# EAGLE design multi-pcb-other (EAGLE 9.6.2)
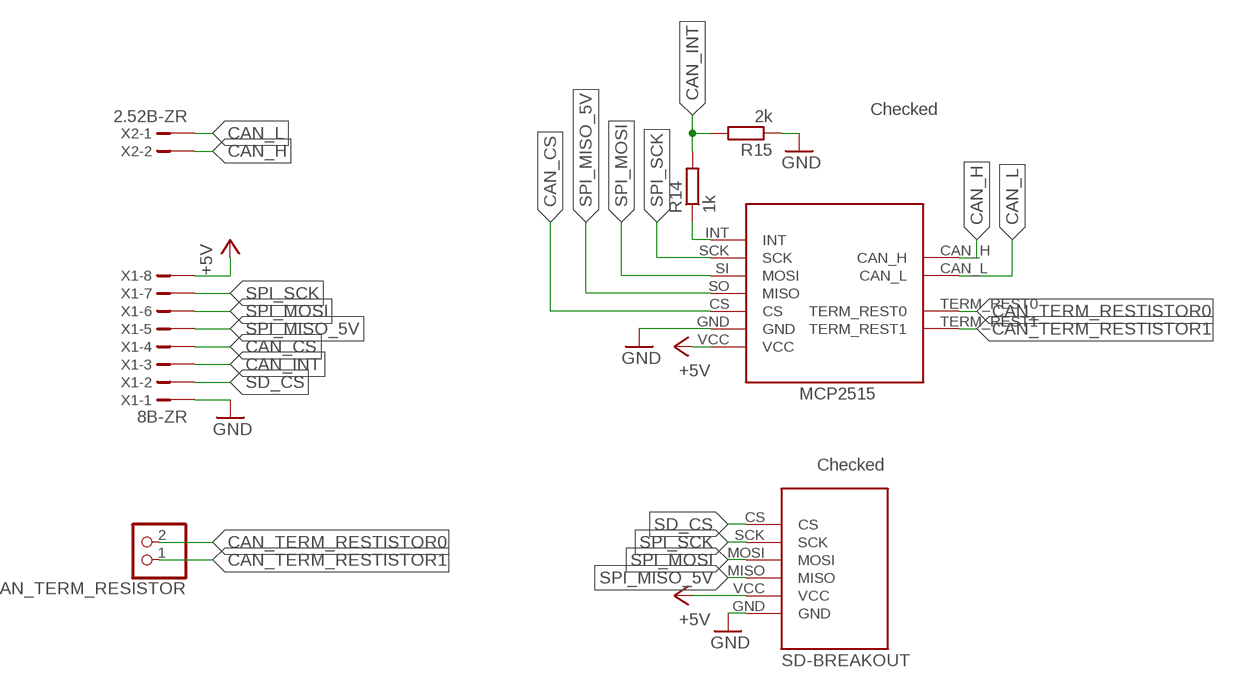
[diagram p0: schematic, sheet 1]

## Parts
CAN_TERM_RESISTOR  PINHD-1X2  [1X02]
R14  1k  R-EU_0207/10  [0207/10]
R15  2k  R-EU_0207/10  [0207/10]
U$2  MCP2515_DEVBOARDMCP2515_DEVBOARD_INVERTED_NODRILL  [MCP2515_DEVBOARD_INVERTED_NODRILL]
U$5  HKD-MICRO-SD-BREAKOUT  [HKD-MICRO-SD-BREAKOUT_NODRILL]
X1  8B-ZR  [B8B-ZR2.5]
X2  2.52B-ZR  [B2B-ZR2.5]

## Nets
+5V: U$2.VCC U$5.VCC X1.8
CAN_CS: U$2.CS X1.4
CAN_H: U$2.CAN_H X2.2
CAN_INT: R14.2 R15.2 X1.3
CAN_L: U$2.CAN_L X2.1
CAN_TERM_RESTISTOR0: CAN_TERM_RESISTOR.2 U$2.TERM_REST0
CAN_TERM_RESTISTOR1: CAN_TERM_RESISTOR.1 U$2.TERM_REST1
GND: R15.1 U$2.GND U$5.GND X1.1
N$10: R14.1 U$2.INT
SD_CS: U$5.CS X1.2
SPI_MISO_5V: U$2.SO(MISO) U$5.MISO X1.5
SPI_MOSI: U$2.SI(MOSI) U$5.MOSI X1.6
SPI_SCK: U$2.SCK U$5.SCK X1.7

## Notes on the sheet
- Checked
- Checked

## Library data of the parts
CAN_TERM_RESISTOR = pinhead:PINHD-1X2: PIN HEADER
R14 R15 = rcl:R-EU_: RESISTOR, European symbol; SPICEPREFIX: R
U$2 = MCP2515:MCP2515_DEVBOARD
U$5 = samuel:HKD-MICRO-SD-BREAKOUT
X1 = con-jst-custom:?8B-ZR: ZH CONNECTOR 1.5 mm, 4 pin 1 row Source: http://www.jst.com .. eZH.pdf
X2 = con-jst-custom:?2B-ZR: ZH CONNECTOR 1.5 mm, 4 pin 1 row Source: http://www.jst.com .. eZH.pdf

## Board
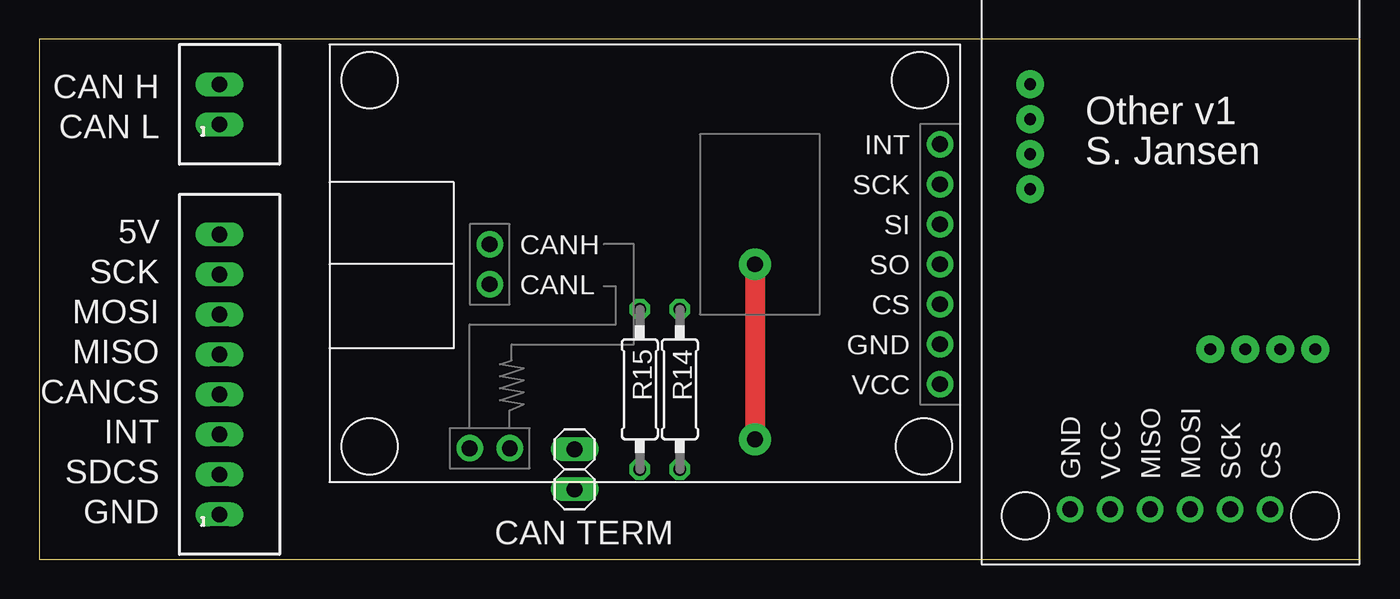
[diagram p1: board, top side]
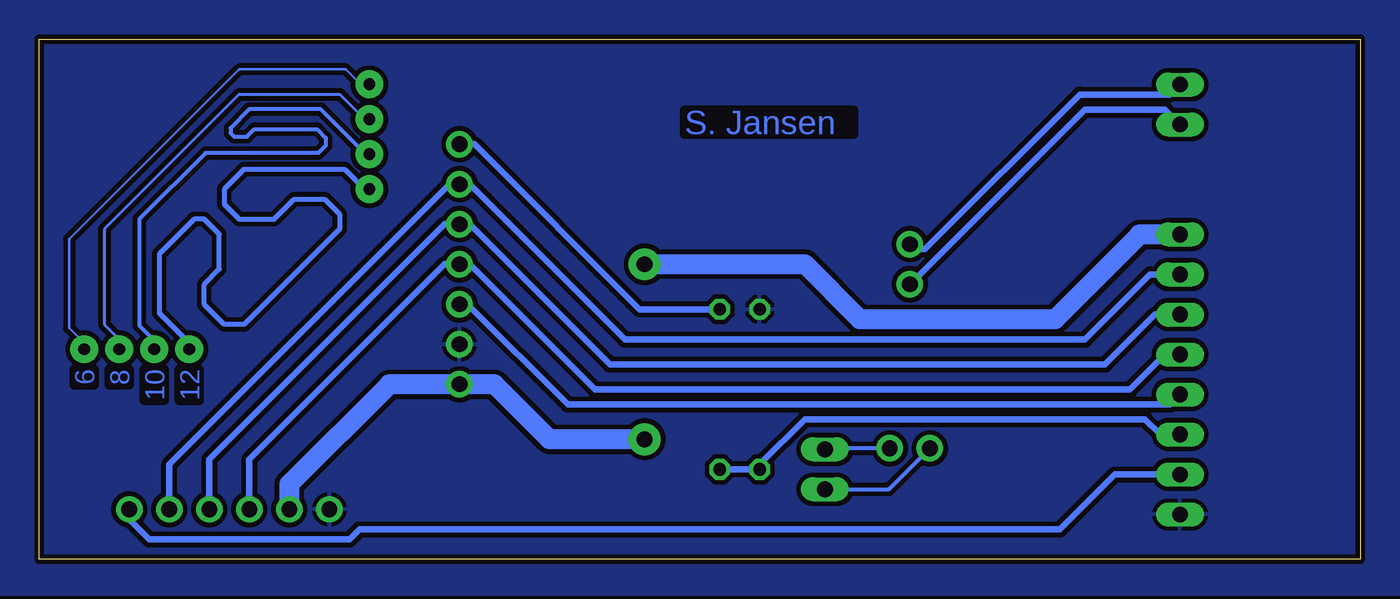
[diagram p2: board, bottom side, seen from below]

Size 83.81 x 33.01 mm. Coordinates in mm from the lower left corner, seen from the top.
Outline: 0,0 83.81,0 83.81,33.01 0,33.01 0,0
Copper layers (1*16): Top 0.035mm / dielectric 1.5mm / Bottom 0.035mm
Design rules "home-made-pcb": minimum track width 8mil, minimum drill 0.3mm, track to track 12mil, track to pad 8mil, pad to pad 10mil, via to via 10mil, smd to smd 6mil, copper to edge 8mil, drill to drill 10mil, minimum pad ring 10mil, minimum via ring 20mil, stop-mask expansion 4mil, vias tented up to drill 0mil, thermal gap 10mil

### Footprints (pad centres in the part's own frame; a part is rotated, then mirrored left to right if it is on the bottom)
1X02 = drill 1.016 long: 1 -1.27,0; 2 1.27,0
0207/10 = drill 0.813 octagon: 1 -5.08,0; 2 5.08,0
MCP2515_DEVBOARD_INVERTED_NODRILL = drill 1 pad 1.676: CAN_H 9.525,-1.27; CAN_L 9.525,1.27; CS -19.05,2.54; GND -19.05,5.08; INT -19.05,-7.62; SCK -19.05,-5.08; SI -19.05,-2.54; SO -19.05,0; TERM_REST0 8.255,11.684; TERM_REST1 10.795,11.684; VCC -19.05,7.62
HKD-MICRO-SD-BREAKOUT_NODRILL = drill 1 pad 1.676: CS -17.78,-6.35; GND -17.78,6.35; MISO -17.78,1.27; MOSI -17.78,-1.27; SCK -17.78,-3.81; VCC -17.78,3.81
B8B-ZR2.5 = drill 1 pad 1.422 long: 1 -8.905,0; 2 -6.363,0; 3 -3.823,0; 4 -1.283,0; 5 1.257,0; 6 3.797,0; 7 6.337,0; 8 8.877,0
B2B-ZR2.5 = drill 1 pad 1.422 long: 1 -1.285,0; 2 1.257,0

### Placement (x,y rotation side)
CAN_TERM_RESISTOR  33.97,5.71 90 top
R14  40.64,10.79 270 top
R15  38.1,10.79 270 top
U$2  38.1,18.73 180 top
U$5  71.75,20.95 90 top
X1  11.43,11.75 90 top
X2  11.43,28.89 90 top

### Tracks (layer width: path | path; a pad name or v marks a point on that pad's centre or on a via)
+5V  (via drill 1)
  Top 1.27: v45.4,18.73 v45.4,7.62
  Bottom 1.27: U$5.VCC 67.94,4.76 61.59,11.11 U$2.VCC 54.93,11.11 51.44,7.62 v45.4,7.62 | X1.8 13.98,20.62 19.37,15.24 31.75,15.24 35.24,18.73 v45.4,18.73
CAN_CS
  Bottom 0.406: U$2.CS 56.64,16.19 50.27,9.83 12.06,9.83 X1.4
CAN_H
  Bottom 0.406: U$2.CAN_H 28.26,19.68 27.62,19.68 17.79,29.51 12.06,29.51 X2.2
CAN_INT
  Bottom 0.406: X1.3 12.69,7.92 13.65,8.89 35.24,8.89 38.1,6.03 R15.2 R14.2
CAN_L
  Bottom 0.406: U$2.CAN_L 17.48,28.56 12.38,28.56 X2.1
CAN_TERM_RESTISTOR0
  Bottom 0.254: U$2.TERM_REST0 33.91,7.05 CAN_TERM_RESISTOR.2
CAN_TERM_RESTISTOR1
  Bottom 0.254: CAN_TERM_RESISTOR.1 29.91,4.45 U$2.TERM_REST1
GND
  pour Bottom (isolate 0.305): -2.54,-2.22 93.98,-2.22 93.98,43.18 -2.54,43.18
  pour Bottom (isolate 0.305): -1.27,-1.27 91.44,-1.27 91.44,43.18 -1.27,43.18
N$1  (via drill 0.75)
  Bottom 0.254: v76.52,13.34 76.52,13.89 77.47,14.84 77.47,21.59 73.26,25.8 66.12,25.8 65.64,26.27 65.64,26.75 66.2,27.3 70.17,27.3 70.64,26.83 71.44,26.83 71.68,27.07 71.68,27.38 70.48,28.57 65.96,28.57 63.1,25.72 v62.87,25.72
N$2  (via drill 0.75)
  Bottom 0.203: v62.87,27.94 63.18,27.94 64.77,29.53 71.12,29.53 79.69,20.95 79.69,14.92 78.74,13.97 v78.74,13.34
N$3  (via drill 0.75)
  Bottom 0.152: v62.87,30.16 63.42,30.16 64.37,31.11 71.12,31.11 81.92,20.32 81.92,14.68 80.96,13.73 v80.96,13.34
N$4  (via drill 0.75)
  Bottom 0.305: v62.87,23.5 63.18,23.5 64.45,24.77 70.8,24.77 72.07,23.5 72.07,22.54 71.12,21.59 68.9,21.59 67.63,22.86 65.72,22.86 64.77,21.91 64.77,20.95 70.8,14.92 72.07,14.92 73.34,16.19 73.34,17.46 72.39,18.41 72.39,20.64 73.34,21.59 73.98,21.59 76.2,19.37 76.2,15.64 74.3,13.73 v74.3,13.34
N$10
  Bottom 0.406: U$2.INT 56.2,26.35 45.72,15.88 R14.1
SD_CS
  Bottom 0.406: X1.2 15.57,5.38 19.05,1.91 63.5,1.91 64.14,1.27 76.83,1.27 78.11,2.54 U$5.CS
SPI_MISO_5V
  Bottom 0.406: U$5.MISO 70.48,6.35 58.1,18.73 U$2.SO 56.52,18.73 48.56,10.78 14.61,10.78 12.38,13 X1.5
SPI_MOSI
  Bottom 0.406: U$5.MOSI 73.03,6.35 58.1,21.27 U$2.SI 56.52,21.27 47.61,12.37 16.19,12.37 13.02,15.54 X1.6
SPI_SCK
  Bottom 0.406: X1.7 13.34,18.08 17.46,13.96 46.66,13.96 56.52,23.81 U$2.SCK 57.78,23.81 75.56,6.03 U$5.SCK

### Text on the board
Bottom: S. Jansen | 12 | 10 | 8 | 6
tPlace: Other v1 | S. Jansen
tNames: CAN H | CAN L | 5V | SCK | MOSI | MISO | CANCS | INT | SDCS | GND | CAN TERM